# Altium schematic sheet Page02 BLOCK DIAGRAM.SchDoc
size 513 x 386 mm; SheetNumber: 2; SheetTotal: 13
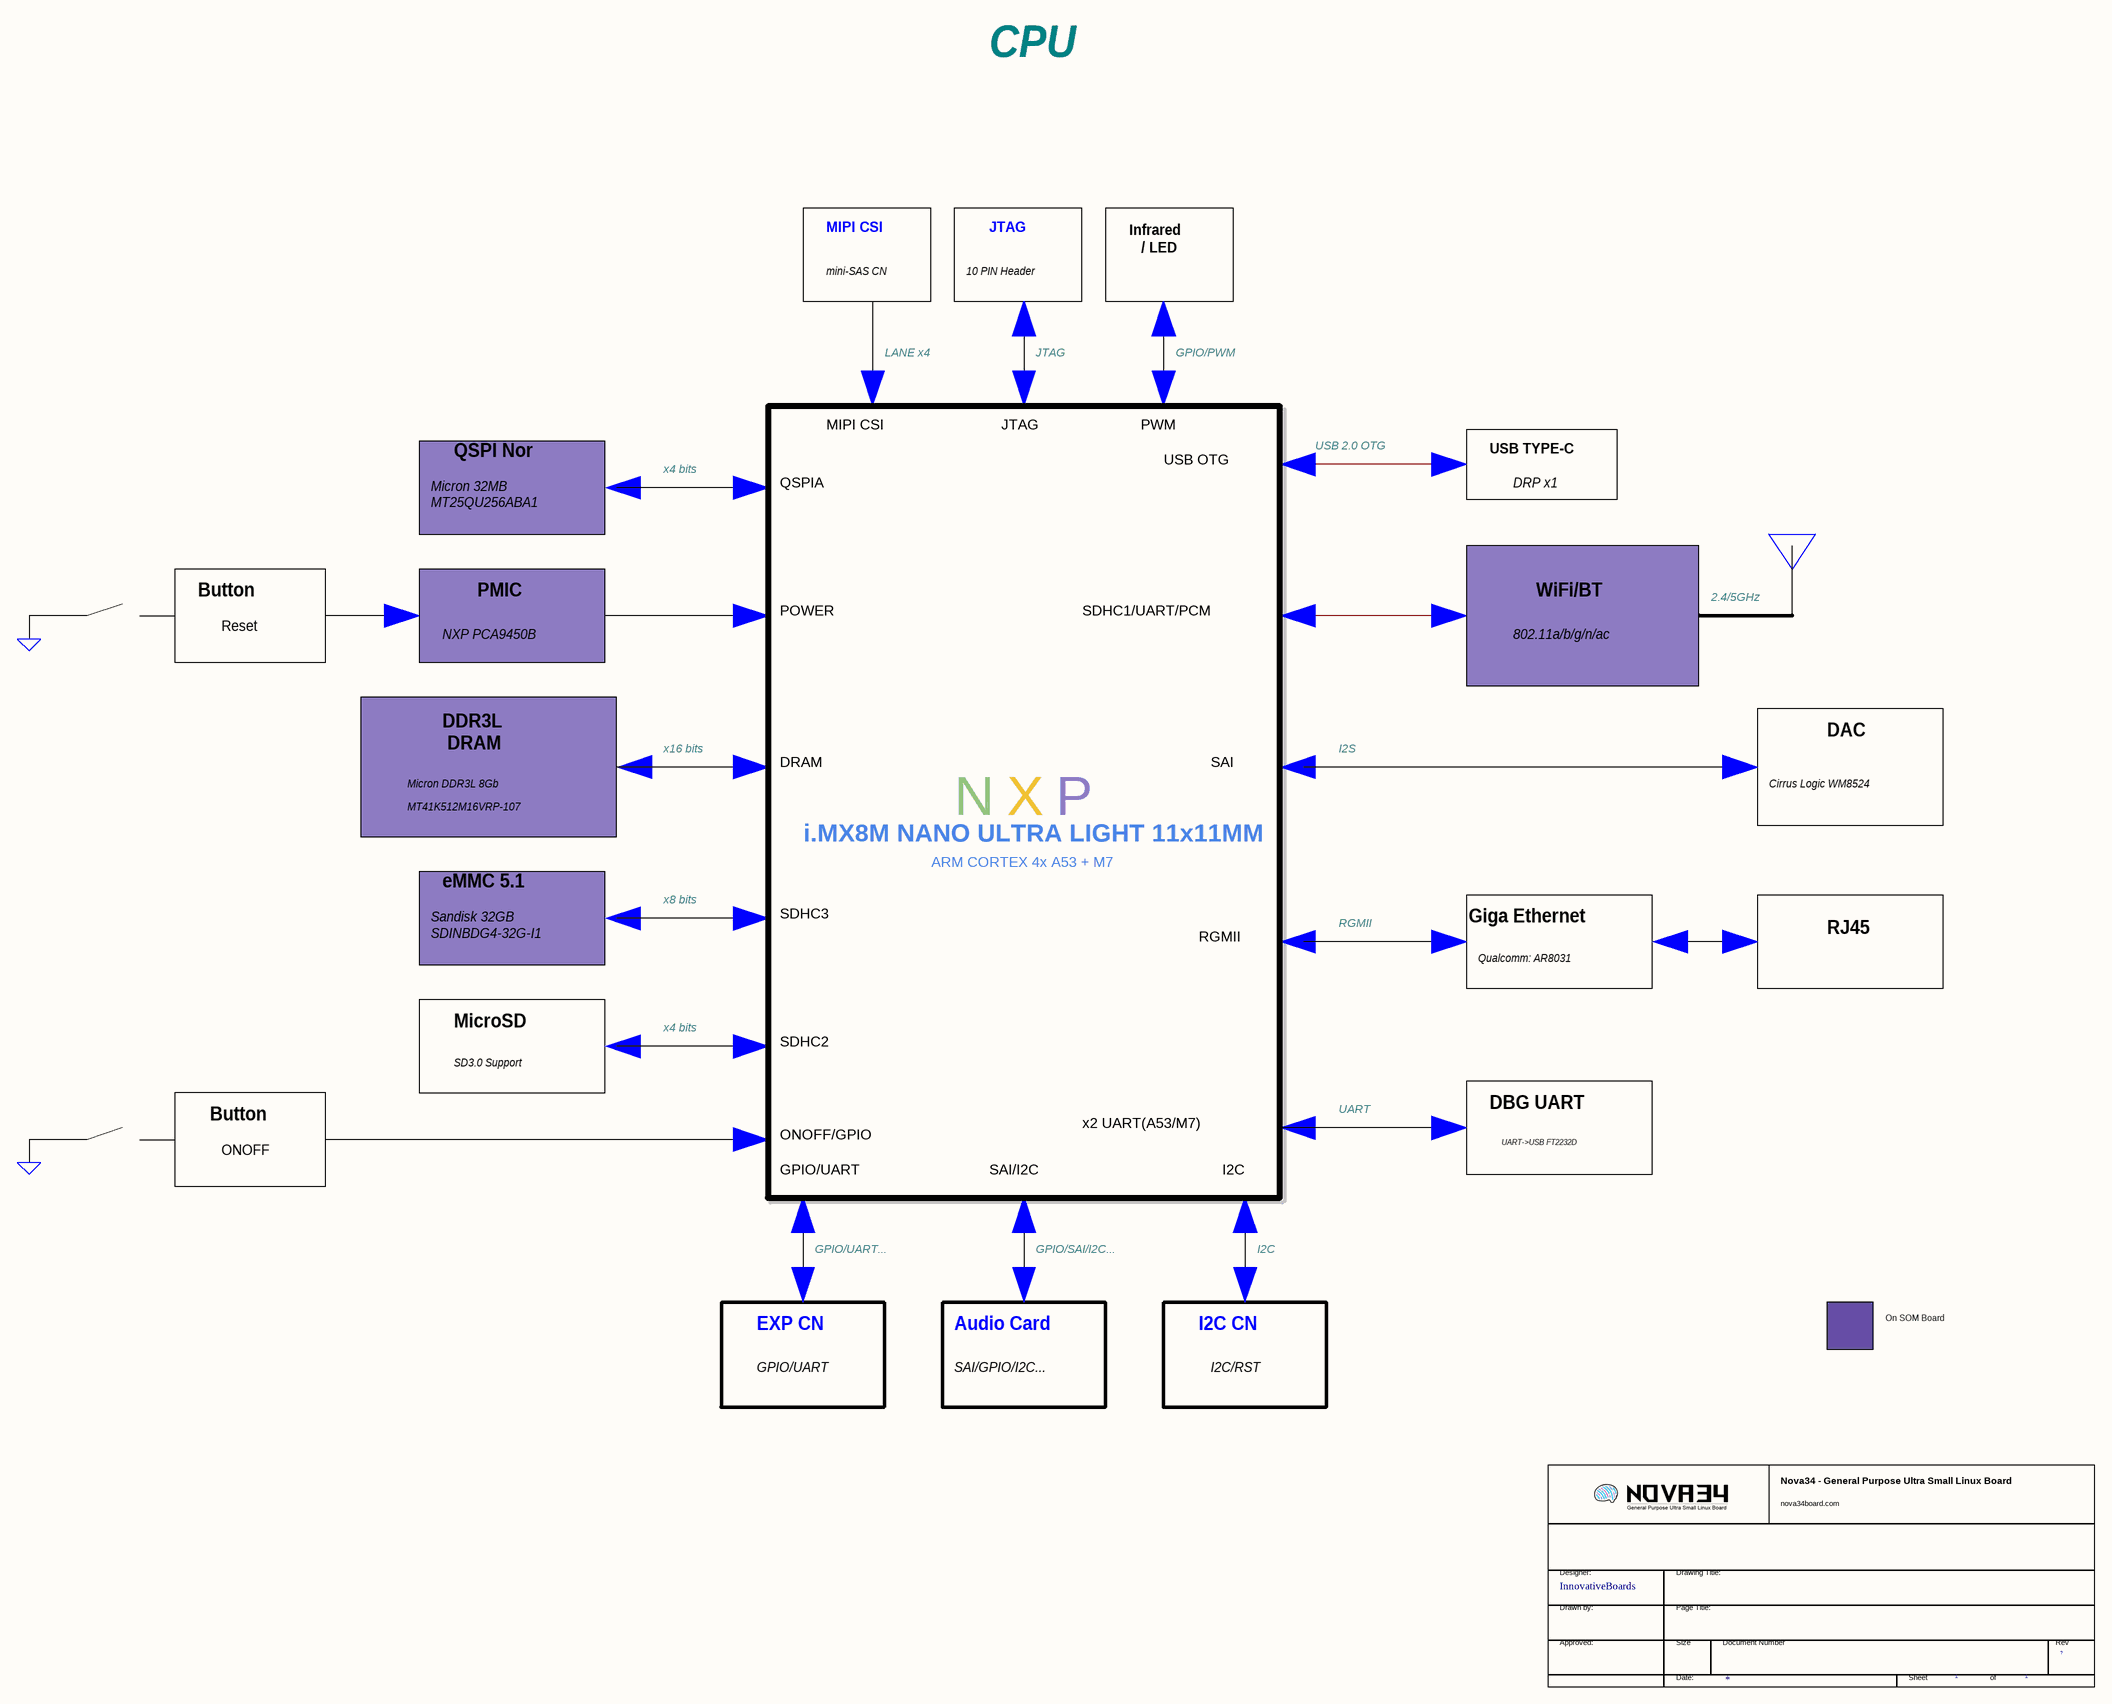
[diagram p0: Page02 BLOCK DIAGRAM.SchDoc]

## Parts
*  Page Count: 1  (hidden comment: TitleBlock_MCPG)  (graphical)

## Notes on the sheet
- CPU
- MIPI CSI
- JTAG
- Infrared
  / LED
- mini-SAS CN
- 10 PIN Header
- LANE x4
- GPIO/PWM
- PWM
- QSPI Nor
- x4 bits
- QSPIA
- USB OTG
- USB 2.0 OTG
- USB TYPE-C
- DRP x1
- Micron 32MB
  MT25QU256ABA1
- Button
- PMIC
- POWER
- SDHC1/UART/PCM
- WiFi/BT
- 2.4/5GHz
- Reset
- NXP PCA9450B
- 802.11a/b/g/n/ac
- Micron DDR3L 8Gb
- DDR3L
  DRAM
- x16 bits
- DRAM
- SAI
- I2S
- Cirrus Logic WM8524
- DAC
- MT41K512M16VRP-107
- i.MX8M NANO ULTRA LIGHT 11x11MM
- N
- X
- P
- eMMC 5.1
- x8 bits
- ARM CORTEX 4x A53 + M7
- Sandisk 32GB
  SDINBDG4-32G-I1
- SDHC3
- RGMII
- Giga Ethernet
- Qualcomm: AR8031
- RJ45
- SD3.0 Support
- MicroSD
- SDHC2
- ONOFF/GPIO
- x2 UART(A53/M7)
- UART
- DBG UART
- ONOFF
- GPIO/UART
- SAI/I2C
- I2C
- UART->USB FT2232D
- GPIO/UART...
- GPIO/SAI/I2C...
- EXP CN
- Audio Card
- SAI/GPIO/I2C...
- I2C CN
- I2C/RST
- On SOM Board
- (in symbol TitleBlock_MCPG) Nova34 - General Purpose Ultra Small Linux Board; nova34board.com; Designer:; Drawing Title:; InnovativeBoards; Drawn by:; Page Title:; Approved:; Size; Document Number; Rev; Date:; Sheet; of

## Library data of the parts
* = TitleBlock_MCPG: Page Create Date: March  8, 1995; Page Number: 1; RevCode: ?; Page Modify Date: *